# Altium schematic sheet Hambmark_PCB-practice-STM32-two-wheel-balancing-car__OTHER_SCHDOC__TB6612FNG.schdoc
size 54 x 55 mm
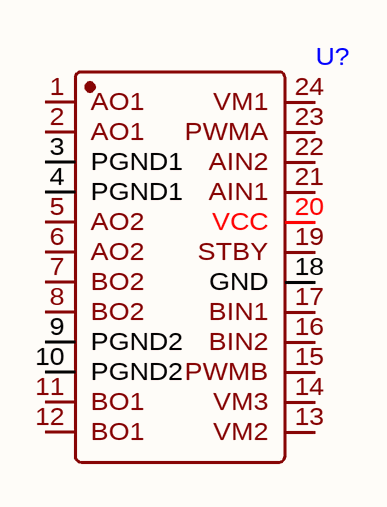
[diagram p0: Hambmark_PCB-practice-STM32-two-wheel-balancing-car__OTHER_SCHDOC__TB6612FNG.schdoc]

## Parts
U?  (no value)  [SSOP-24_L8.4-W5.8-P0.65-LS7.8-BL]

## Nets

Not connected (* = marked no-connect by the designer): U? 1(AO1) 2(AO1) 3(PGND1) 4(PGND1) 5(AO2) 6(AO2) 7(BO2) 8(BO2) 9(PGND2) 10(PGND2) 11(BO1) 12(BO1) 13(VM2) 14(VM3) 15(PWMB) 16(BIN2) 17(BIN1) 18(GND) 19(STBY) 20(VCC) 21(AIN1) 22(AIN2) 23(PWMA) 24(VM1)

## Library data of the parts
U? = TB6612FNG(O,C,8,EL